# EAGLE schematic Schematic_Sensing_Module (EAGLE 9.6.2)
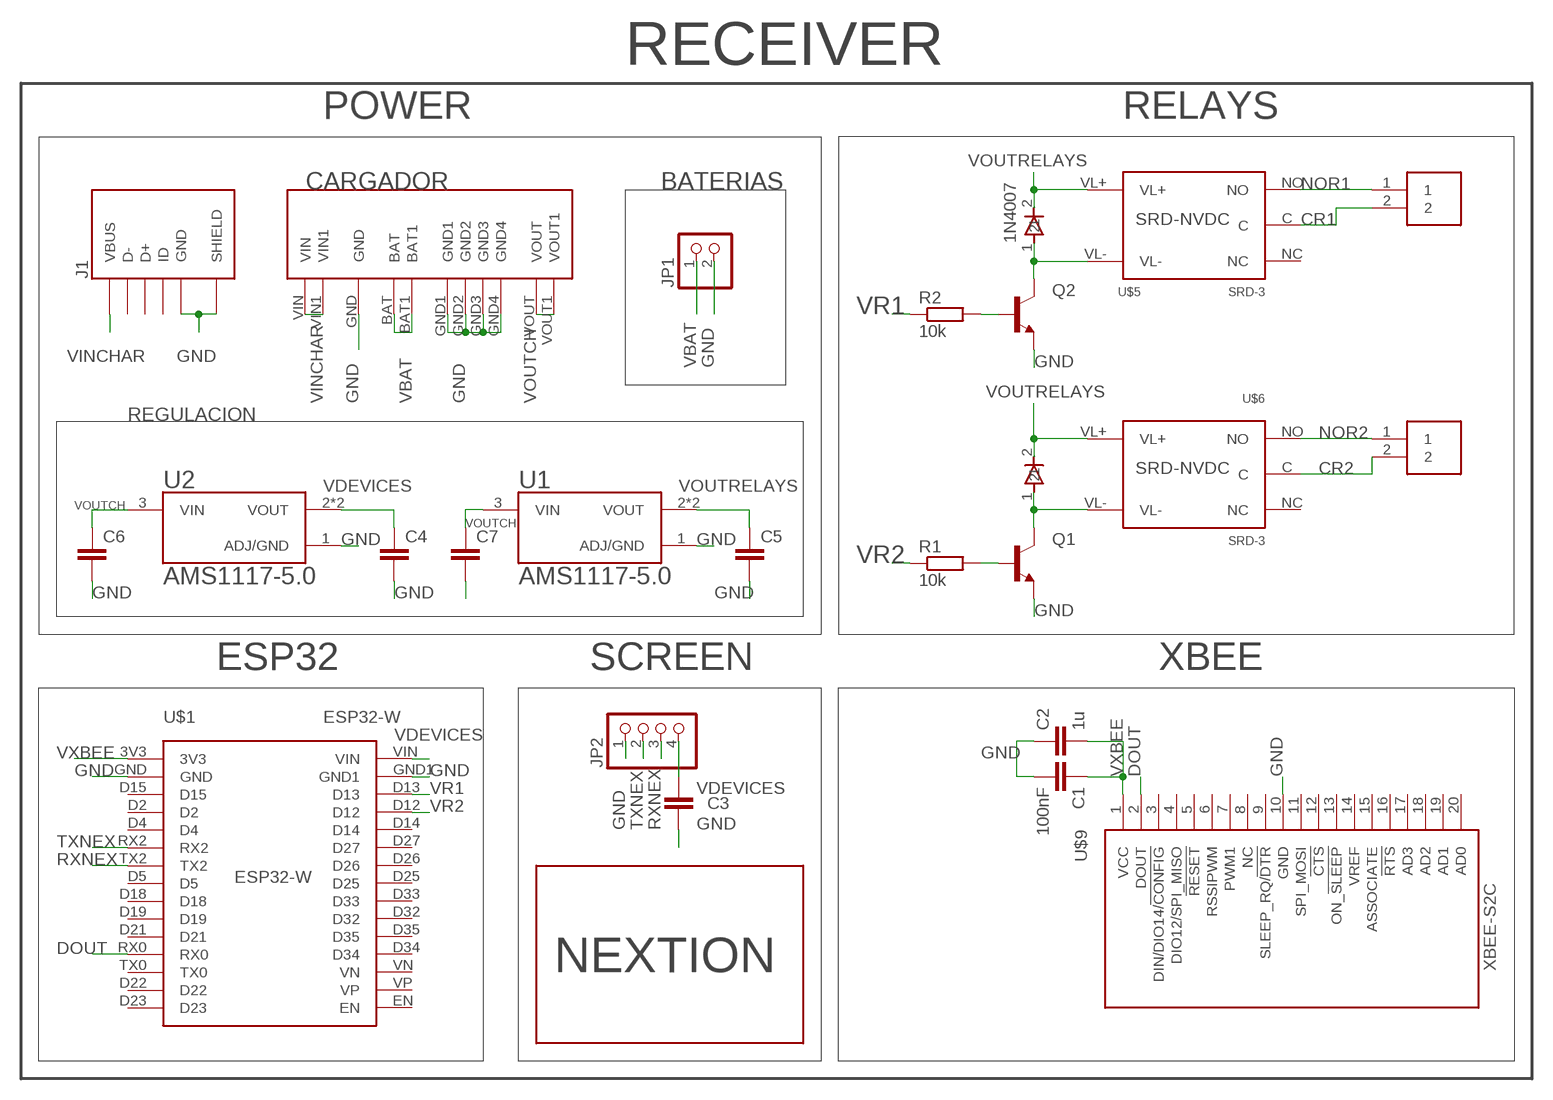
[diagram p0: schematic, sheet 1]

## Parts
1N4007  1N4007SMA  [SMA]
1N4007SMA  1N4007SMA  [SMA]
C1  100nF  C-EUC1206  [C1206]
C2  1u  C-EUC1206  [C1206]
C3  100nF  C-EUC1206  [C1206]
C4  C-EUC1206  [C1206]
C5  C-EUC1206  [C1206]
C6  C-EUC1206  [C1206]
C7  C-EUC1206  [C1206]
CARGADOR  MODULO_CARGA_5V  [MODULO_CARGA_5V]
J1  USB3090-XX-X_REVE  [GCT_USB3090-XX-X_REVE]
JP1  PINHD-1X2  [1X02]
JP2  PINHD-1X4  [1X04]
Q1  MMBT2222A  [SOT23]
Q2  MMBT2222A  [SOT23]
R1  10k  R-EU_R1206  [R1206]
R2  10k  R-EU_R1206  [R1206]
REL1  TERMINAL-TB2  [TERMINAL-TB2]
REL2  TERMINAL-TB2  [TERMINAL-TB2]
U1  AMS1117-5.0  [SOT229P700X180-4N]
U2  AMS1117-5.0  [SOT229P700X180-4N]
U$1  ESP32-W  [DIP]
U$2  NX4024T032  [NX4024T032]
U$5  SRD-3  [SRD-N]
U$6  SRD-3  [SRD-N]
U$9  XBEE-S2C  [XBEE-DIP]

## Nets
CR1: REL1.2 U$5.C
CR2: REL2.2 U$6.C
DOUT: U$1.RX0 U$9.2(DOUT)
GND: C1.2 C2.1 C3.2 C4.2 C5.2 C6.2 C7.2 CARGADOR.GND CARGADOR.GND1 CARGADOR.GND2 CARGADOR.GND3 CARGADOR.GND4 J1.5(GND) J1.6(SHIELD) J1.7(SHIELD) J1.8(SHIELD) J1.9(SHIELD) JP1.2 JP2.1 Q1.2(E) Q2.2(E) U1.1(ADJ/GND) U2.1(ADJ/GND) U$1.GND U$1.GND1 U$9.10(GND)
N$5: Q2.1(B) R2.2
N$6: 1N4007SMA.1 Q1.3(C) U$6.VL-
N$7: Q1.1(B) R1.2
N$8: 1N4007.1 Q2.3(C) U$5.VL-
NOR1: REL1.1 U$5.NO
NOR2: REL2.1 U$6.NO
RXNEX: JP2.3 U$1.TX2
TXNEX: JP2.2 U$1.RX2
VBAT: CARGADOR.BAT CARGADOR.BAT1 JP1.1
VDEVICES: C3.1 C4.1 JP2.4 U2.2(VOUT) U2.4(VOUT) U$1.VIN
VINCHAR: CARGADOR.VIN CARGADOR.VIN1 J1.1(VBUS)
VOUTCH: C6.1 C7.1 CARGADOR.VOUT CARGADOR.VOUT1 U1.3(VIN) U2.3(VIN)
VOUTRELAYS: 1N4007.2 1N4007SMA.2 C5.1 U1.2(VOUT) U1.4(VOUT) U$5.VL+ U$6.VL+
VR1: R2.1 U$1.D13
VR2: R1.1 U$1.D12
VXBEE: C1.1 C2.2 U$1.3V3 U$9.1(VCC)
Unconnected: J1.2(D-) J1.3(D+) J1.4(ID) U$1.D2 U$1.D4 U$1.D5 U$1.D14 U$1.D15 U$1.D18 U$1.D19 U$1.D21 U$1.D22 U$1.D23 U$1.D25 U$1.D26 U$1.D27 U$1.D32 U$1.D33 U$1.D34 U$1.D35 U$1.EN U$1.TX0 U$1.VN U$1.VP U$5.NC U$6.NC U$9.3(DIN/DIO14/!CONFIG) U$9.4(DIO12/SPI_MISO) U$9.5(!RESET) U$9.6(RSSIPWM) U$9.7(PWM1) U$9.8(NC) U$9.9(SLEEP_RQ/!DTR) U$9.11(SPI_MOSI) U$9.12(!CTS) U$9.13(ON_!SLEEP) U$9.14(VREF) U$9.15(ASSOCIATE) U$9.16(!RTS) U$9.17(AD3) U$9.18(AD2) U$9.19(AD1) U$9.20(AD0)

## Notes on the sheet
- RECEIVER
- POWER | RELAYS
- BATERIAS
- REGULACION
- ESP32 | SCREEN | XBEE

## Library data of the parts
1N4007 1N4007SMA = 1n400X:1N4007SMA
C1-C7 = rcl:C-EU: CAPACITOR, European symbol; SPICEPREFIX: C
CARGADOR = Modulo_Carga:MODULO_CARGA_5V
J1 = USB3090-XX-X_REVE:USB3090-XX-X_REVE: Micro USB Receptacle, Type AB, SMT, R/A, Bottom Mount, w/out Peg, w/outer shell stakes Check prices <https://pricing.snapeda.com/parts/USB3090-30-A/Global%20Connector%20Technology/view-part?ref=eda>; AVAILABILITY: Warning; DESCRIPTION: USB - micro AB USB 2.0 Receptacle Connector 5 Position Surface Mount, Right Angle; Through Hole, 2.35mm profile, 5 Pins, Horizontal, Bottom mount; MF: Global Connector Technology; MP: USB3090-30-A; PACKAGE: None; PRICE: None; PURCHASE-URL: https://pricing.snapeda.com/search/part/USB3090-30-A/?ref=eda
JP1 = pinhead:PINHD-1X2: PIN HEADER
JP2 = pinhead:PINHD-1X4: PIN HEADER
Q1 Q2 = MMBT2222A:MMBT2222A: 2N2222 General Purpose NPN Transistor Check prices <https://pricing.snapeda.com/parts/MMBT2222A/ON%20Semiconductor/view-part?ref=eda>; AVAILABILITY: Good; DESCRIPTION: Bipolar (BJT) Transistor NPN 40V 600mA 300MHz 225mW Surface Mount SOT-23; MF: ON Semiconductor; MP: MMBT2222A; PACKAGE: None; PRICE: None
R1 R2 = rcl:R-EU_: RESISTOR, European symbol; SPICEPREFIX: R
REL1 REL2 = TERMINAL-TB001:TERMINAL-TB2
U1 U2 = AMS1117-5.0:AMS1117-5.0: Sot223/Pkg 1-Amp 5-Volt Low Drop Out Voltage Regulatator; AVAILABILITY: Unavailable; DESCRIPTION: Sot223/Pkg 1-Amp 5-Volt Low Drop Out Voltage Regulatator; MF: Advanced Monolithic Systems; MP: AMS1117-5.0; PACKAGE: None; PRICE: None
U$1 = ESP32-W:ESP32-W
U$2 = NEXTION:NX4024T032
U$5 U$6 = RELE-SRD:SRD-3
U$9 = XBEES2:XBEE-S2C